# Altium schematic sheet Sensor.SchDoc
size A2
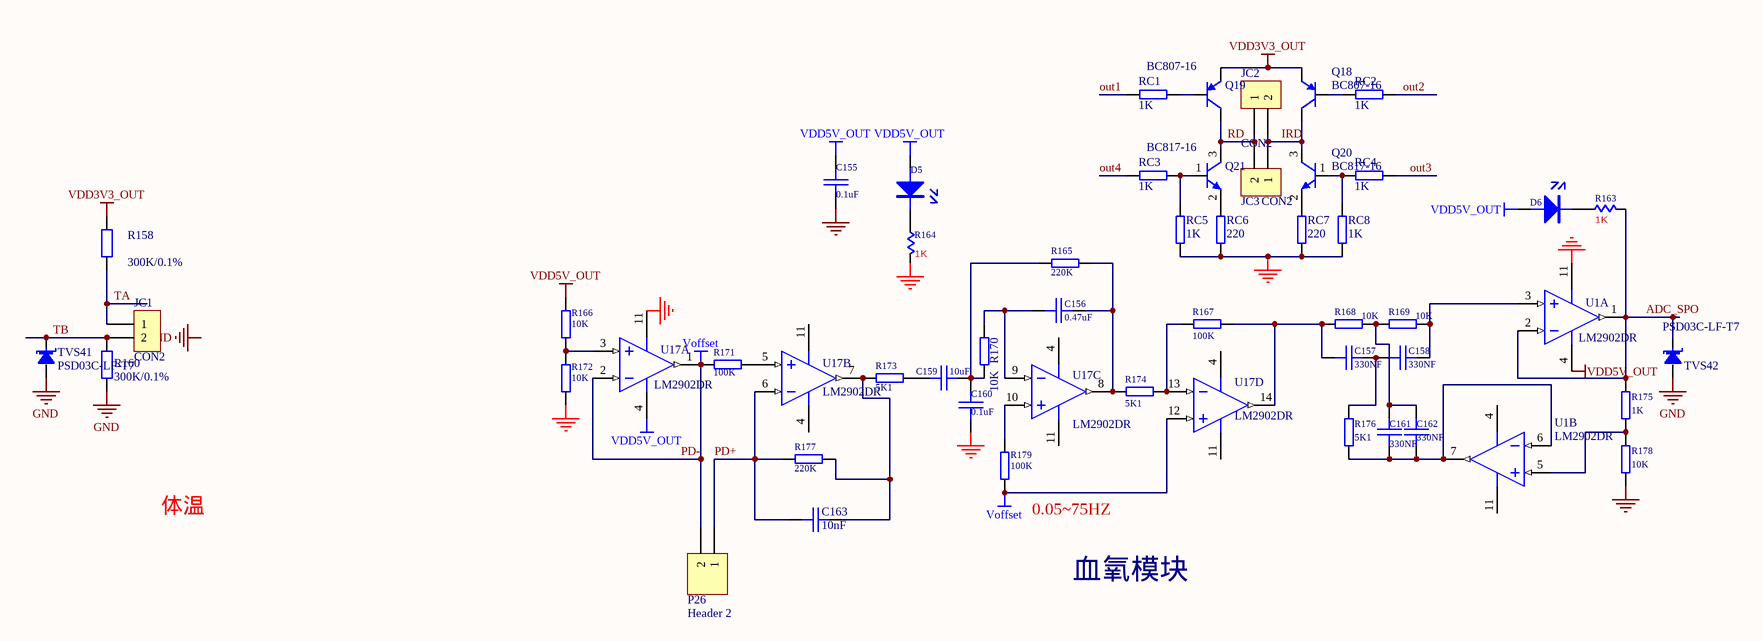
[diagram p0: Sensor.SchDoc]

## Parts
C155  0.1uF  [C0603]
C156  0.47uF  [C0603]
C157  330NF  [C0603]
C158  330NF  [C0603]
C159  10uF  [C0603]
C160  0.1uF  [C0603]
C161  330NF  [C0603]
C162  330NF  [C0603]
C163  10nF  [0603C]
D5  LED  [LED0603]  (value not drawn)
D6  LED  [LED0603]  (value not drawn)
JC1  CON2  [2X2.54MMZ]
JC2  CON2  [2X2.54MMZ]
JC3  CON2  [2X2.54MMZ]
P26  Header 2  [2X2.54MMZ]
Q18  BC807-16  [SOT-23]
Q19  BC807-16  [SOT-23]
Q20  BC817-16  [SOT-23]
Q21  BC817-16  [SOT-23]
R158  300K/0.1%  [SMD-0603]
R160  300K/0.1%  [SMD-0603]
R163  1K  [0603R]
R164  1K  [0603R]
R165  220K  [0603R]
R166  10K  [0603R]
R167  100K  [0603R]
R168  10K  [0603R]
R169  10K  [0603R]
R170  10K  [0603R]
R171  100K  [0603R]
R172  10K  [0603R]
R173  5K1  [0603R]
R174  5K1  [0603R]
R175  1K  [0603R]
R176  5K1  [0603R]
R177  220K  [0603R]
R178  10K  [0603R]
R179  100K  [0603R]
RC1  1K  [0603R]
RC2  1K  [0603R]
RC3  1K  [0603R]
RC4  1K  [0603R]
RC5  1K  [0603R]
RC6  220  [0603R]
RC7  220  [0603R]
RC8  1K  [0603R]
TVS41  PSD03C-LF-T7  [SOD-323]
TVS42  PSD03C-LF-T7  [SOD-323]
U1  LM2902DR  [SO-14Z]  (parts A,B of 4)
U17  LM2902DR  [SO-14Z]  (parts A,B,C,D of 4)

## Nets
GND: C155.1 C160.2 R160.1 R164.2 R172.1 R178.2 RC5.1 RC6.2 RC7.2 RC8.1 TVS41.1(A) TVS42.1(A) U1.11(VEE) U17.11(VEE)
PD-: P26.2 R171.1 R179.1 U17.1(1_OUT) U17.2(1_IN-) U17.12(4_IN+)  [also labelled Voffset]
VDD3V3_OUT: Q18.2(E) Q19.2(E) R158.2
VDD5V_OUT: C155.2 D5.1(A) D6.1(A) R166.2 U1.4(VCC) U17.4(VCC)
ADC_SPO: R163.2 R175.1 TVS42.2(B) U1.1(1_OUT) U1.2(1_IN-)
IRD: JC2.2 JC3.1 Q18.3(C) Q20.3(C)
out1: RC1.2
out2: RC2.2
out3: RC4.2
out4: RC3.2
PD+: C163.2 P26.1 R177.2 U17.6(2_IN-)
RD: JC2.1 JC3.2 Q19.3(C) Q21.3(C)
TA: JC1.1 R158.1
TB: JC1.2 R160.2 TVS41.2(B)
NetC156_1: C156.1 R165.2 R174.1 U17.8(3_OUT)
NetC156_2: C156.2 R170.2 U17.9(3_IN-)
NetC157_1: C157.1 R167.2 R168.1 U17.14(4_OUT)
NetC157_2: C157.2 C158.1 R176.1
NetC158_2: C158.2 R169.2 U1.3(1_IN+)
NetC159_1: C159.1 C160.1 R165.1 R170.1
NetC159_2: C159.2 R173.1
NetC161_1: C161.1 C162.1 R176.2 U1.6(2_IN-) U1.7(2_OUT)
NetC161_2: C161.2 C162.2 R168.2 R169.1
NetC163_1: C163.1 R173.2 R177.1 U17.7(2_OUT)
NetD5_2: D5.2(K) R164.1
NetD6_2: D6.2(K) R163.1
NetQ18_1: Q18.1(B) RC2.1
NetQ19_1: Q19.1(B) RC1.1
NetQ20_1: Q20.1(B) RC4.1 RC8.2
NetQ20_2: Q20.2(E) RC7.1
NetQ21_1: Q21.1(B) RC3.1 RC5.2
NetQ21_2: Q21.2(E) RC6.1
NetR166_1: R166.1 R172.2 U17.3(1_IN+)
NetR167_1: R167.1 R174.2 U17.13(4_IN-)
NetR171_2: R171.2 U17.5(2_IN+)
NetR175_2: R175.2 R178.1 U1.5(2_IN+)
NetR179_2: R179.2 U17.10(3_IN+)

## Notes on the sheet
- 体温
- (near R179) 0.05~75HZ
- 血氧模块
- Labels drawn without touching a wire or pin: GND

## Library data of the parts
C155-C163 = CAP: Capacitor
D5 D6 = DIODE_LED: Diode
JC1-JC3 = CON2: Connector
P26 = Header 2: Header, 2-Pin; LatestRevisionDate: 17-Jul-2002; LatestRevisionNote: Re-released for DXP Platform.; Publisher: Altium Limited
Q18 Q19 = PNP
Q20 Q21 = NPN-1: 三极管
R158 R160 = R: 贴片电阻 1%
R163 R164 = RES-SMD: Value: 1K
R165-R179 RC1-RC8 = RES2
TVS41 TVS42 = TVS-S: 单向TVS
U1 U17 = TLC274: Low Power Quad Operational Amplifier